# Altium schematic sheet Sheet8.SchDoc
size A4
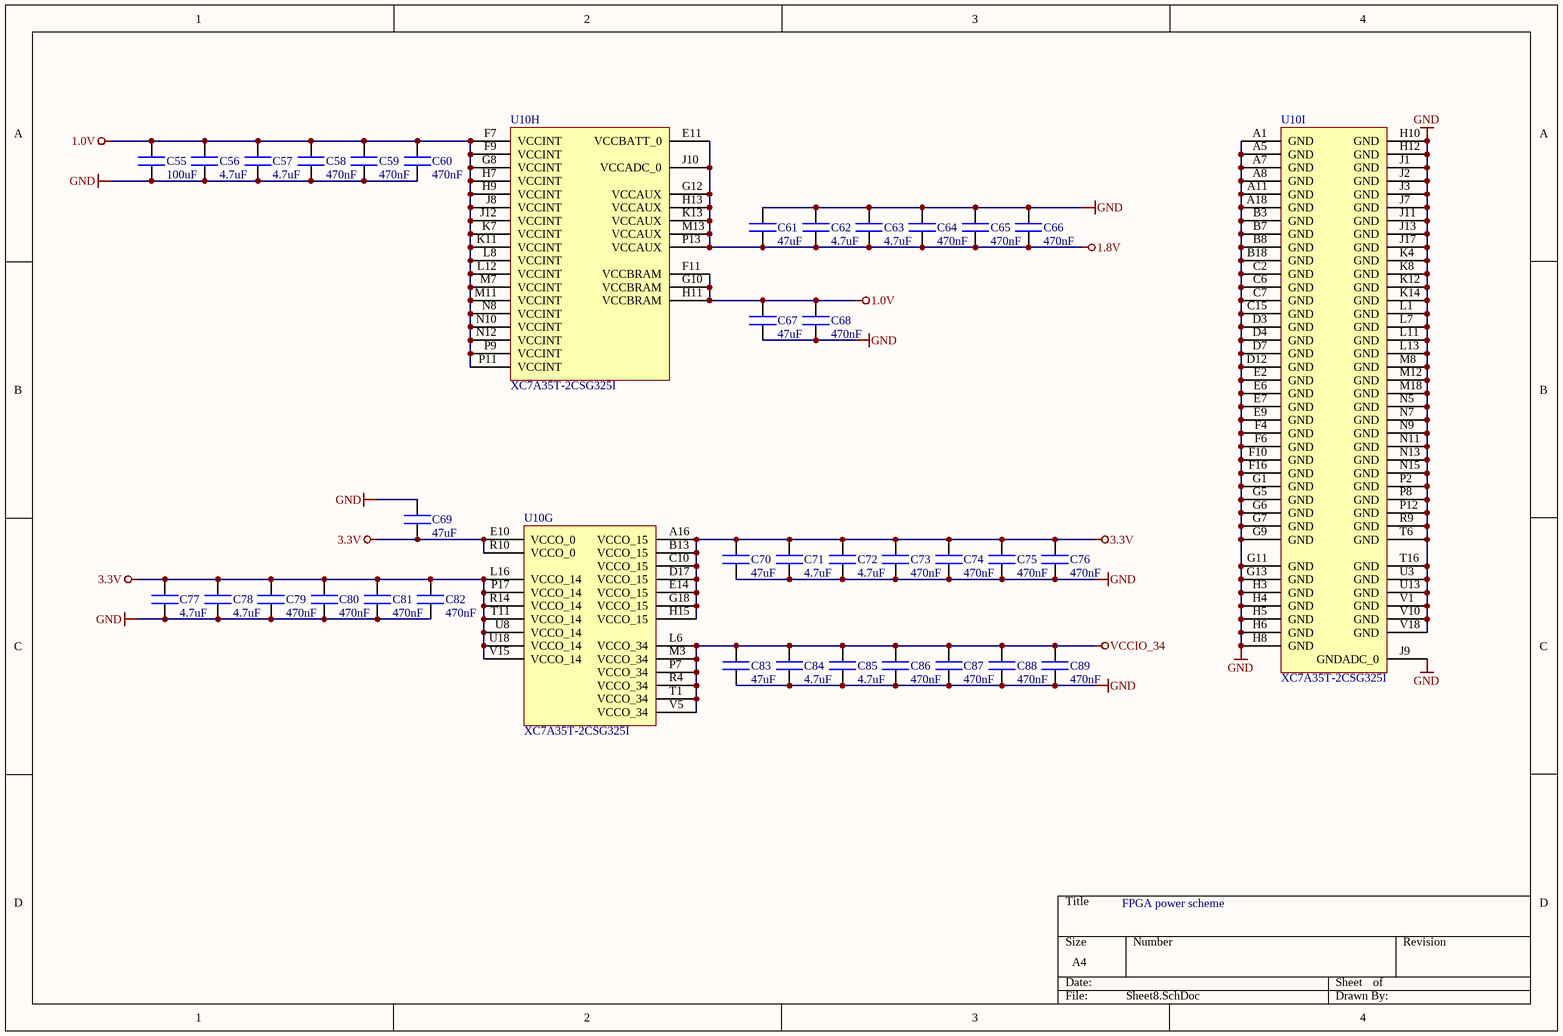
[diagram p0: Sheet8.SchDoc]

## Parts
C55  100uF  [CAPC3216X16N]
C56  4.7uF  [CAPC1005X05L]
C57  4.7uF  [CAPC1005X05L]
C58  470nF  [CAPC1005X05L]
C59  470nF  [CAPC1005X05L]
C60  470nF  [CAPC1005X05L]
C61  47uF  [CAPC2012X12N]
C62  4.7uF  [CAPC1005X05L]
C63  4.7uF  [CAPC1005X05L]
C64  470nF  [CAPC1005X05L]
C65  470nF  [CAPC1005X05L]
C66  470nF  [CAPC1005X05L]
C67  47uF  [CAPC2012X12N]
C68  470nF  [CAPC1005X05L]
C69  47uF  [CAPC2012X12N]
C70  47uF  [CAPC2012X12N]
C71  4.7uF  [CAPC1005X05L]
C72  4.7uF  [CAPC1005X05L]
C73  470nF  [CAPC1005X05L]
C74  470nF  [CAPC1005X05L]
C75  470nF  [CAPC1005X05L]
C76  470nF  [CAPC1005X05L]
C77  4.7uF  [CAPC1005X05L]
C78  4.7uF  [CAPC1005X05L]
C79  470nF  [CAPC1005X05L]
C80  470nF  [CAPC1005X05L]
C81  470nF  [CAPC1005X05L]
C82  470nF  [CAPC1005X05L]
C83  47uF  [CAPC2012X12N]
C84  4.7uF  [CAPC1005X05L]
C85  4.7uF  [CAPC1005X05L]
C86  470nF  [CAPC1005X05L]
C87  470nF  [CAPC1005X05L]
C88  470nF  [CAPC1005X05L]
C89  470nF  [CAPC1005X05L]
U10  XC7A35T-2CSG325I  [XC7A35T-2CSG325I]  (parts G,H,I of 9)

## Nets
1.0V: C55.2 C56.2 C57.2 C58.2 C59.2 C60.2 C67.2 C68.1 U10.F7(VCCINT) U10.F9(VCCINT) U10.F11(VCCBRAM) U10.G8(VCCINT) U10.G10(VCCBRAM) U10.H7(VCCINT) U10.H9(VCCINT) U10.H11(VCCBRAM) U10.J8(VCCINT) U10.J12(VCCINT) U10.K7(VCCINT) U10.K11(VCCINT) U10.L8(VCCINT) U10.L12(VCCINT) U10.M7(VCCINT) U10.M11(VCCINT) U10.N8(VCCINT) U10.N10(VCCINT) U10.N12(VCCINT) U10.P9(VCCINT) U10.P11(VCCINT)
1.8V: C61.1 C62.1 C63.1 C64.1 C65.1 C66.1 U10.E11(VCCBATT_0) U10.G12(VCCAUX) U10.H13(VCCAUX) U10.J10(VCCADC_0) U10.K13(VCCAUX) U10.M13(VCCAUX) U10.P13(VCCAUX)
3.3V: C69.2 C70.2 C71.2 C72.2 C73.2 C74.2 C75.2 C76.2 C77.2 C78.2 C79.2 C80.2 C81.2 C82.2 U10.A16(VCCO_15) U10.B13(VCCO_15) U10.C10(VCCO_15) U10.D17(VCCO_15) U10.E10(VCCO_0) U10.E14(VCCO_15) U10.G18(VCCO_15) U10.H15(VCCO_15) U10.L16(VCCO_14) U10.P17(VCCO_14) U10.R10(VCCO_0) U10.R14(VCCO_14) U10.T11(VCCO_14) U10.U8(VCCO_14) U10.U18(VCCO_14) U10.V15(VCCO_14)
GND: C55.1 C56.1 C57.1 C58.1 C59.1 C60.1 C61.2 C62.2 C63.2 C64.2 C65.2 C66.2 C67.1 C68.2 C69.1 C70.1 C71.1 C72.1 C73.1 C74.1 C75.1 C76.1 C77.1 C78.1 C79.1 C80.1 C81.1 C82.1 C83.1 C84.1 C85.1 C86.1 C87.1 C88.1 C89.1 U10.A1(GND) U10.A5(GND) U10.A7(GND) U10.A8(GND) U10.A11(GND) U10.A18(GND) U10.B3(GND) U10.B7(GND) U10.B8(GND) U10.B18(GND) U10.C2(GND) U10.C6(GND) U10.C7(GND) U10.C15(GND) U10.D3(GND) U10.D4(GND) U10.D7(GND) U10.D12(GND) U10.E2(GND) U10.E6(GND) U10.E7(GND) U10.E9(GND) U10.F4(GND) U10.F6(GND) U10.F10(GND) U10.F16(GND) U10.G1(GND) U10.G5(GND) U10.G6(GND) U10.G7(GND) U10.G9(GND) U10.G11(GND) U10.G13(GND) U10.H3(GND) U10.H4(GND) U10.H5(GND) U10.H6(GND) U10.H8(GND) U10.H10(GND) U10.H12(GND) U10.J1(GND) U10.J2(GND) U10.J3(GND) U10.J7(GND) U10.J9(GNDADC_0) U10.J11(GND) U10.J13(GND) U10.J17(GND) U10.K4(GND) U10.K8(GND) U10.K12(GND) U10.K14(GND) U10.L1(GND) U10.L7(GND) U10.L11(GND) U10.L13(GND) U10.M8(GND) U10.M12(GND) U10.M18(GND) U10.N5(GND) U10.N7(GND) U10.N9(GND) U10.N11(GND) U10.N13(GND) U10.N15(GND) U10.P2(GND) U10.P8(GND) U10.P12(GND) U10.R9(GND) U10.T6(GND) U10.T16(GND) U10.U3(GND) U10.U13(GND) U10.V1(GND) U10.V10(GND) U10.V18(GND)
VCCIO_34: C83.2 C84.2 C85.2 C86.2 C87.2 C88.2 C89.2 U10.L6(VCCO_34) U10.M3(VCCO_34) U10.P7(VCCO_34) U10.R4(VCCO_34) U10.T1(VCCO_34) U10.V5(VCCO_34)

## Notes on the sheet
- FPGA power scheme

## Library data of the parts
C55 = C1206: Ceramic Chip Capacitor; Value: 100uF
C56-C60 C62-C66 C68 C71-C82 C84-C89 = C0402: Ceramic Chip Capacitor
  C56 C57 C62 C63 C71 C72 C77 C78 C84 C85: Value: 4.7uF
  C58-C60 C64-C66 C68 C73-C76 C79-C82 C86-C89: Value: 470nF
C61 C67 C69 C70 C83 = C0805: Ceramic Chip Capacitor; Value: 47uF
U10 = XC7A35T-2CSG325I: Artix-7 FPGA, 150 User I/Os, 4 GTP, 324-Ball BGA, Speed Grade 2, Industrial Grade, Pb-Free; Manufacturer: Xilinx; Total Block RAM: 1800 Kb; GTP: 4; Clock Mgmt Tiles (CMTs): 5; Logic Cells: 33280; Available User I/O: 150; Speed Grades: 2; DatasheetVersion: v1.15; PackageVersion: Rev. 1.11; PackageReference: CSG-325; PackageDescription: 324-Ball Wire-Bond Chip-Scale BGA, Body 15 x 15 mm, Pitch 0.8 mm; Maximum Distributed RAM: 400 Kb; Operating Temperature Range: Industrial; NexusDeviceID: XC7A35T-2CSG325I; Mounting Technology: Surface Mount; PartNumber: XC7A35T-2CSG325I; ComponentLink1Description: Manufacturer URL; ComponentLink1URL: http://www.xilinx.com/; ComponentLink2Description: Datasheet; ComponentLink2URL: http://www.xilinx.com/support/documentation/data_sheets/ds180_7Series_Overview.pdf; ComponentLink3Description: Package Specification; ComponentLink3URL: http://www.xilinx.com/support/documentation/user_guides/ug475_7Series_Pkg_Pinout.pdf; ComponentLink4Description: DC and Switching Characteristics; ComponentLink4URL: http://www.xilinx.com/support/documentation/data_sheets/ds181_Artix_7_Data_Sheet.pdf; ComponentLink5Description: Package File; ComponentLink5URL: http://www.xilinx.com/support/packagefiles/a7packages/xc7a200tsbg484pkg.txt; ComponentLink6Description: Packaging and Pinout; ComponentLink6URL: http://www.xilinx.com/support/documentation/user_guides/ug475_7Series_Pkg_Pinout.pdf